# Altium schematic sheet board1.SchDoc
size A4 portrait
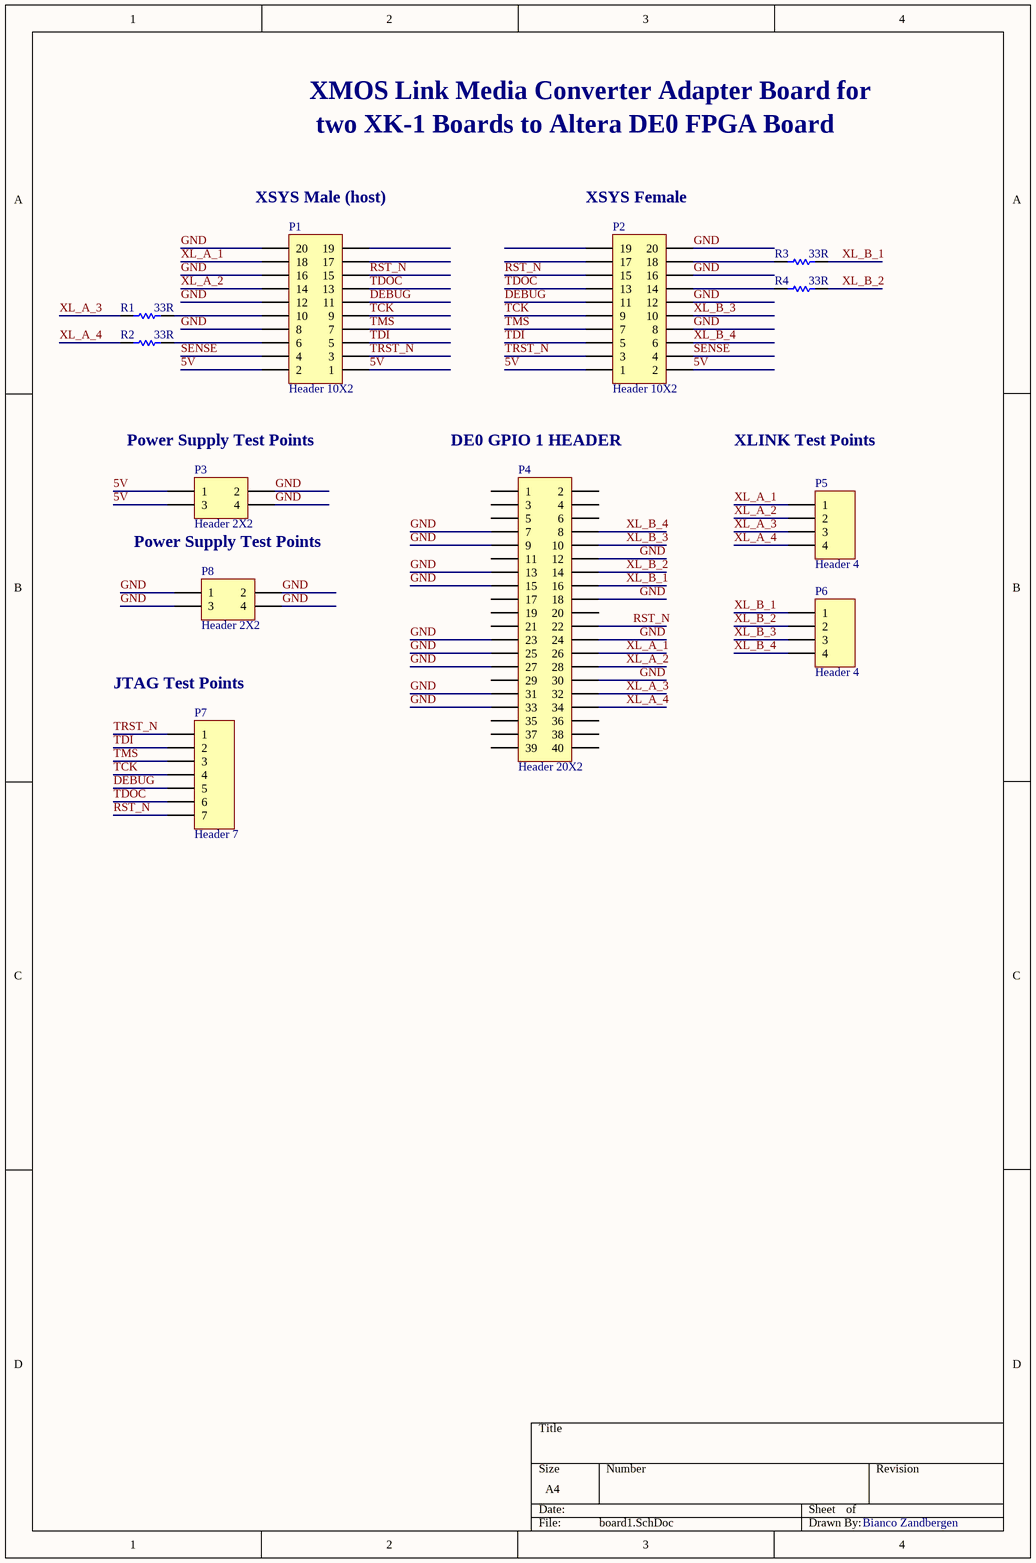
[diagram p0: board1.SchDoc]

## Parts
P1  Header 10X2  [HDR2X10]
P2  Header 10X2  [HDR2X10_MIRROR]
P3  Header 2X2  [HDR2X2]
P4  Header 20X2  [HDR2X20]
P5  Header 4  [HDR1X4]
P6  Header 4  [HDR1X4]
P7  Header 7  [HDR1X7]
P8  Header 2X2  [HDR2X2]
R1  value 33R  [2012[0805]_RES]  (hidden comment: Res1)
R2  value 33R  [2012[0805]_RES]  (hidden comment: Res1)
R3  value 33R  [2012[0805]_RES]  (hidden comment: Res1)
R4  value 33R  [2012[0805]_RES]  (hidden comment: Res1)

## Nets
5V: P1.1 P1.2 P2.1 P2.2 P3.1 P3.3
DEBUG: P1.11 P2.11 P7.5
GND: P1.8 P1.12 P1.16 P1.20 P2.8 P2.12 P2.16 P2.20 P3.2 P3.4 P4.7 P4.9 P4.12 P4.13 P4.15 P4.18 P4.23 P4.24 P4.25 P4.27 P4.30 P4.31 P4.33 P8.1 P8.2 P8.3 P8.4
RST_N: P1.15 P2.15 P4.22 P7.7
SENSE: P1.4 P2.4
TCK: P1.9 P2.9 P7.4
TDI: P1.5 P2.5 P7.2
TDOC: P1.13 P2.13 P7.6
TMS: P1.7 P2.7 P7.3
TRST_N: P1.3 P2.3 P7.1
XL_A_1: P1.18 P4.26 P5.1
XL_A_2: P1.14 P4.28 P5.2
XL_A_3: P4.32 P5.3 R1.1
XL_A_4: P4.34 P5.4 R2.1
XL_B_1: P4.16 P6.1 R3.2
XL_B_2: P4.14 P6.2 R4.2
XL_B_3: P2.10 P4.10 P6.3
XL_B_4: P2.6 P4.8 P6.4
NetP1_6: P1.6 R2.2
NetP1_10: P1.10 R1.2
NetP2_14: P2.14 R4.1
NetP2_18: P2.18 R3.1

Not connected (* = marked no-connect by the designer): P1 17 19; P2 17 19; P4 1 2 3 4 5 6 11 17 19 20 21 29 35 36 37 38 39 40

## Notes on the sheet
- XMOS Link Media Converter Adapter Board for
- two XK-1 Boards to Altera DE0 FPGA Board
- (near P1) XSYS Male (host)
- (near P2) XSYS Female
- Power Supply Test Points
- DE0 GPIO 1 HEADER
- XLINK Test Points
- (near P7) JTAG Test Points
- Bianco Zandbergen

## Library data of the parts
P1 P2 = Header 10X2: Header, 10-Pin, Dual row; LatestRevisionDate: 17-Jul-2002; LatestRevisionNote: Re-released for DXP Platform.; Publisher: Altium Limited
P3 P8 = Header 2X2: Header, 2-Pin, Dual row; LatestRevisionDate: 17-Jul-2002; LatestRevisionNote: Re-released for DXP Platform.; Publisher: Altium Limited
P4 = Header 20X2: Header, 20-Pin, Dual row; LatestRevisionDate: 17-Jul-2002; LatestRevisionNote: Re-released for DXP Platform.; Publisher: Altium Limited
P5 P6 = Header 4: Header, 4-Pin; LatestRevisionDate: 17-Jul-2002; LatestRevisionNote: Re-released for DXP Platform.; Publisher: Altium Limited
P7 = Header 7: Header, 7-Pin; LatestRevisionDate: 17-Jul-2002; LatestRevisionNote: Re-released for DXP Platform.; Publisher: Altium Limited
R1-R4 = Res1: Resistor; Published: 8-Jun-2000; LatestRevisionDate: 17-Jul-2002; LatestRevisionNote: Re-released for DXP Platform.; PackageReference: AXIAL-0.3; Publisher: Altium Limited